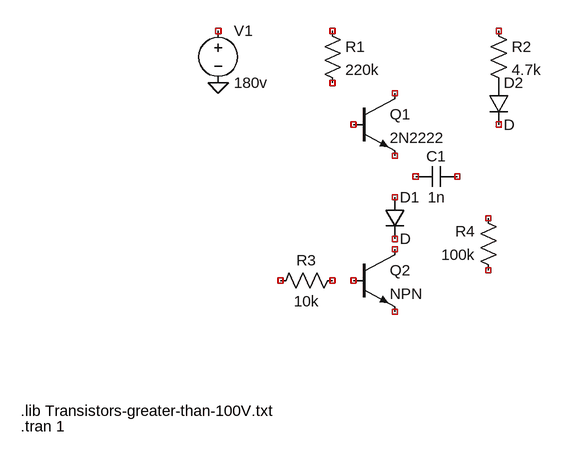
[diagram p0: schematic simulation.asc]
simulation.asc, the LTspice schematic file:
Version 4
SHEET 1 880 680
FLAG 144 112 0
SYMBOL voltage 144 16 R0
WINDOW 123 0 0 Left 0
WINDOW 39 0 0 Left 0
SYMATTR InstName V1
SYMATTR Value 180v
SYMBOL res 304 16 R0
SYMATTR InstName R1
SYMATTR Value 220k
SYMBOL res 560 16 R0
SYMATTR InstName R2
SYMATTR Value 4.7k
SYMBOL res 336 400 R90
WINDOW 0 0 56 VBottom 2
WINDOW 3 32 56 VTop 2
SYMATTR InstName R3
SYMATTR Value 10k
SYMBOL res 576 416 R180
WINDOW 0 36 76 Left 2
WINDOW 3 36 40 Left 2
SYMATTR InstName R4
SYMATTR Value 100k
SYMBOL npn 352 128 R0
SYMATTR InstName Q1
SYMATTR Value 2N2222
SYMBOL npn 352 368 R0
SYMATTR InstName Q2
SYMBOL cap 512 240 R90
WINDOW 0 0 32 VBottom 2
WINDOW 3 32 32 VTop 2
SYMATTR InstName C1
SYMATTR Value 1n
SYMBOL diode 400 288 R0
SYMATTR InstName D1
SYMBOL diode 560 112 R0
SYMATTR InstName D2
TEXT -160 616 Left 2 !.lib Transistors-greater-than-100V.txt
TEXT -160 640 Left 2 !.tran 1

The netlist it stands for:
* simulation.asc
V1 NC_01 0 180v
R1 NC_02 NC_03 220k
R2 NC_04 P001 4.7k
R3 NC_05 NC_06 10k
R4 NC_07 NC_08 100k
Q1 NC_09 NC_10 NC_11 0 2N2222
Q2 NC_12 NC_13 NC_14 0 NPN
C1 NC_15 NC_16 1n
D1 NC_17 NC_18 D
D2 P001 NC_19 D
.model D D
.lib standard.dio
.model NPN NPN
.model PNP PNP
.lib standard.bjt
.lib Transistors-greater-than-100V.txt
.tran 1
.backanno
.end